# EAGLE design Grove - Single Axis Analog Gyro v1.0 (EAGLE 6.3)
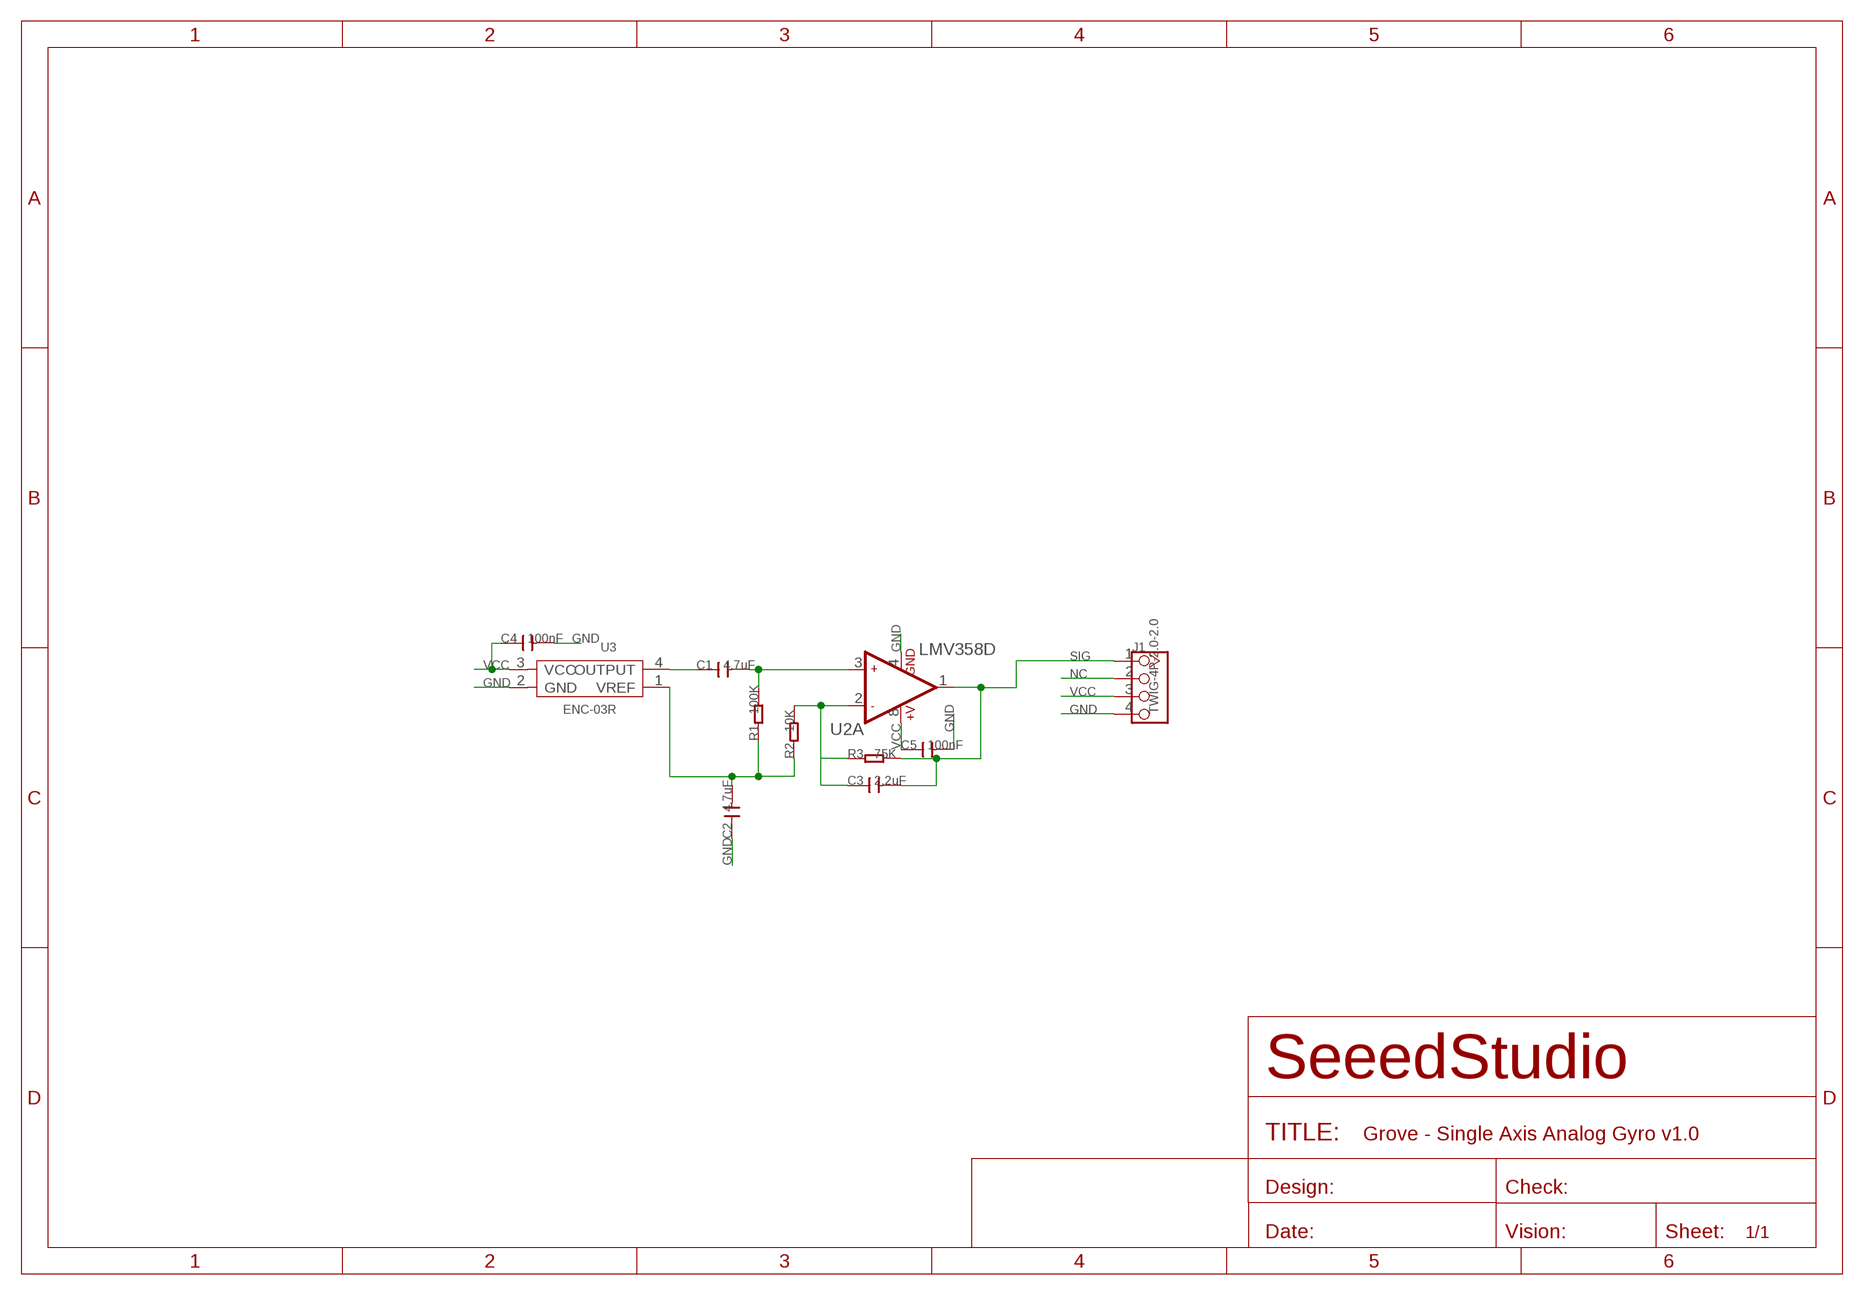
[diagram p0: schematic, sheet 1]

## Parts
C1  4.7uF  C-0805  [C0805]
C2  4.7uF  C-0805  [C0805]
C3  2.2uF  C-0805  [C0805]
C4  100nF  C-0603  [C0603]
C5  100nF  C-0603  [C0603]
J1  TWIG-4P-2.0-2.0  [4P-2.0]
R1  100K  R-0603  [R0603]
R2  10K  R-0603  [R0603]
R3  75K  R-0603  [R0603]
U2  LMV358D  [SO08]
U3  ENC-03R  ENC-03R'ENC-03RC-R'  [4P-SMD-8X4X2H]

## Nets
GND: C2.1 C4.2 C5.2 J1.4 U2.4(A:GND) U3.2(GND)
N$1: C1.1 U3.4(OUTPUT)
N$2: C1.2 R1.2 U2.3(A:+IN1)
N$3: C2.2 R1.1 R2.1 U3.1(VREF)
N$4: C3.1 R2.2 R3.1 U2.2(A:-IN1)
NC: J1.2
SIG: C3.2 J1.1 R3.2 U2.1(A:OUT1)
VCC: C4.1 C5.1 J1.3 U2.8(A:+V) U3.3(VCC)
Unconnected: U2.5(B:+IN2) U2.6(B:-IN2) U2.7(B:OUT2)

## Library data of the parts
C1-C5 = Discrete:C*: Ceramic Capacitors
J1 = Connector:TWIG-4P-2.0
R1-R3 = Discrete:R*
U2 = IC:LMV358: General purpose LOW Voltage, Rail-to-Rail Output Amplifiers http://www.fairchildsemi.com/ds/LM/LMV358.pdf
U3 = template:ENC-03R: This product is an angular rate sensor that uses the phenomenon of Coriolis force, which is generated when a rotational angular rate is applied to the vibrator. Murata's original, small ceramic bimorph vibrator and simple Cap-Base structure realize their ultra-small size, under 0.1cc. Their small shape and light weight increase flexibility of installment and help to downsize your equipment. This surface mountable device can, be mounted by an automatic surface mounter.

## Board
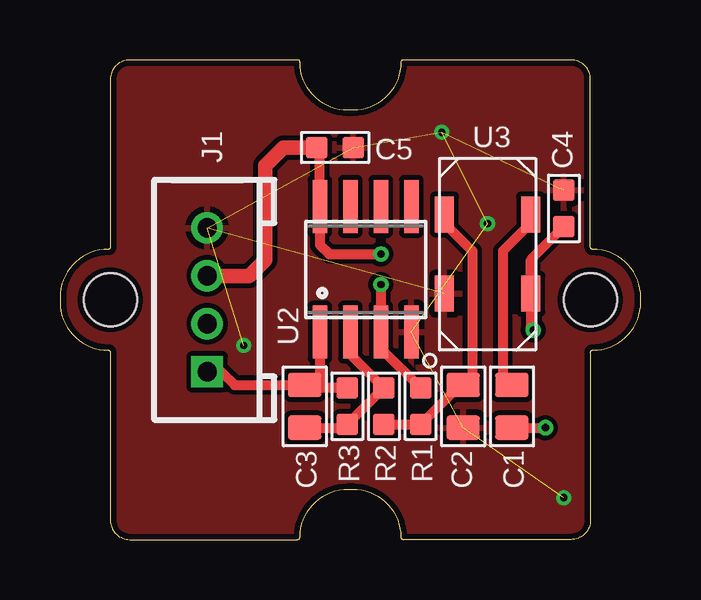
[diagram p1: board, top side]
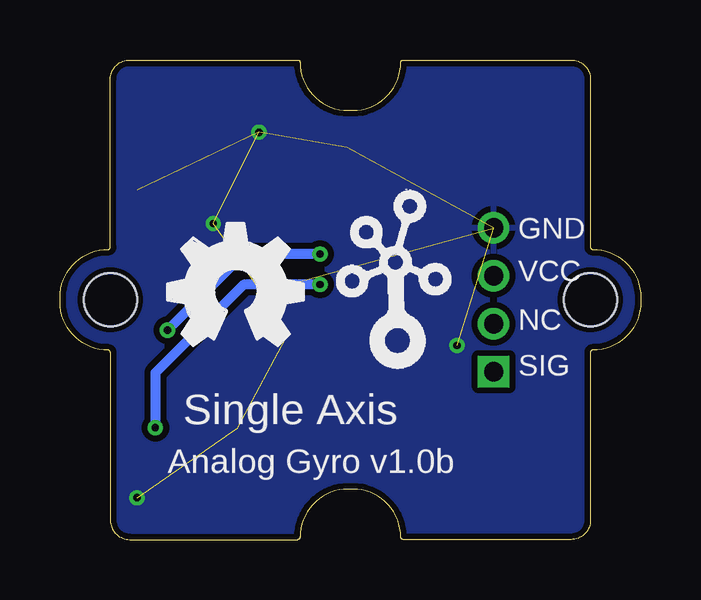
[diagram p2: board, bottom side, seen from below]

Size 24.2 x 20 mm. Coordinates in mm from the lower left corner, seen from the top.
Copper layers (1*16): Top 0.035mm / dielectric 1.5mm / Bottom 0.035mm
Design rules "SeeedStudio_rule_no_angle_090911": minimum track width 6mil, minimum drill 12mil, track to track 6mil, track to pad 6mil, pad to pad 6mil, via to via 6mil, smd to smd 0mil, copper to edge 10mil, drill to drill 10mil, minimum pad ring 10mil, minimum via ring 6mil, stop-mask expansion 2mil, vias tented up to drill 25mil, thermal gap 10mil

### Footprints (pad centres in the part's own frame; a part is rotated, then mirrored left to right if it is on the bottom)
C0805 = smd 1.016 x 1.397: 1 -0.889,0; 2 0.889,0
C0603 = smd 0.889 x 0.889: 1 -0.762,0; 2 0.762,0
4P-2.0 = drill 0.8 pad 1.27 square: 1 -3,0 | drill 0.8 pad 1.27: 2 -1,0; 3 1,0; 4 3,0
R0603 = smd 0.889 x 0.889: 1 -0.762,0; 2 0.762,0
SO08 = smd 0.61 x 2.21: 1 -1.905,-2.616; 2 -0.635,-2.616; 3 0.635,-2.616; 4 1.905,-2.616; 5 1.905,2.616; 6 0.635,2.616; 7 -0.635,2.616; 8 -1.905,2.616
4P-SMD-8X4X2H = smd 1.5 x 0.8: 1 -1.65,-1.8; 2 1.65,-1.8; 3 1.65,1.8; 4 -1.65,1.8
1U-DIM-W/-DRILL = hole 2.2: 0,-10; 0,10

### Placement (x,y rotation side)
C1  18.83,5.55 270 top
C2  16.8,5.55 90 top
C3  10.2,5.55 90 top
C4  20.99,13.81 90 top
C5  11.46,16.35 0 top
J1  6.13,10 90 top
R1  15.02,5.55 90 top
R2  13.5,5.55 90 top
R3  11.97,5.55 90 top
U2  12.73,11.27 0 top
U3  17.81,11.9 270 top
U$1  [1U-DIM-W/-DRILL]  12.1,10 270 top
U$2  [OSHW_FILLX200_NOTEXT]  19.72,8.1 0 bottom
U$3  [TWIGLOGO]  10.2,8.1 0 bottom

### Tracks (layer width: path | path; a pad name or v marks a point on that pad's centre or on a via)
GND  (via drill 0.3 pad 0.64)  (9 unrouted)
  other vias: 15.91,16.98 17.81,13.18 20.99,1.74 7.65,8.1
  pour Bottom (isolate 0.254): -0.6,-0.16 24.8,-0.16 24.8,20.16 -0.6,20.16 -0.6,-0.03
  pour Top (isolate 0.203): -0.6,-0.16 24.8,-0.16 24.8,20.16 -0.6,20.16 -0.6,-0.03
N$1
  Top 0.406: U3.4 19.61,13.2 18.45,12.03 18.45,6.57 18.58,6.44 C1.1
N$2  (via drill 0.3 pad 0.64)
  Top 0.406: R1.2 13.37,7.97 U2.3 v13.37,10.63 | C1.2 v20.23,4.67
  Bottom 0.406: v13.37,10.63 16.55,10.63 20.23,6.95 v20.23,4.67
N$3
  Top 0.406: R2.1 R1.1 16.67,6.44 C2.2 17.05,6.44 17.18,6.57 17.18,12.03 16.02,13.2 U3.1
N$4
  Top 0.406: U2.2 12.1,7.71 R2.2 R3.1 11.85,4.67 C3.1
SIG
  Top 0.406: R3.2 11.08,6.32 | 11.08,6.32 10.83,6.32 | 10.83,6.32 C3.2 7.27,6.44 6.72,7 J1.1 | U2.1 10.83,6.57 | 10.83,6.57 10.83,6.32 | 11.08,6.32 10.83,6.57
VCC  (via drill 0.3 pad 0.64)  (1 unrouted)
  Top 0.406: 10.83,16.22 U2.8 10.83,12.29 11.21,11.9 v13.37,11.9 | 19.47,10.25 U3.3 19.61,8.84 v19.72,8.73 | U3.3 19.61,11.67 C4.1
  Top 0.61: J1.3 7.89,11 8.54,11.65 8.54,15.59 9.31,16.35 C5.1 10.83,16.22
  Bottom 0.406: v13.37,11.9 16.55,11.9 v19.72,8.73

### Text on the board
bPlace: GND | VCC | NC | SIG | Single Axis | Analog Gyro v1.0b